# EAGLE design debouncer_4x (EAGLE 6.6.0)
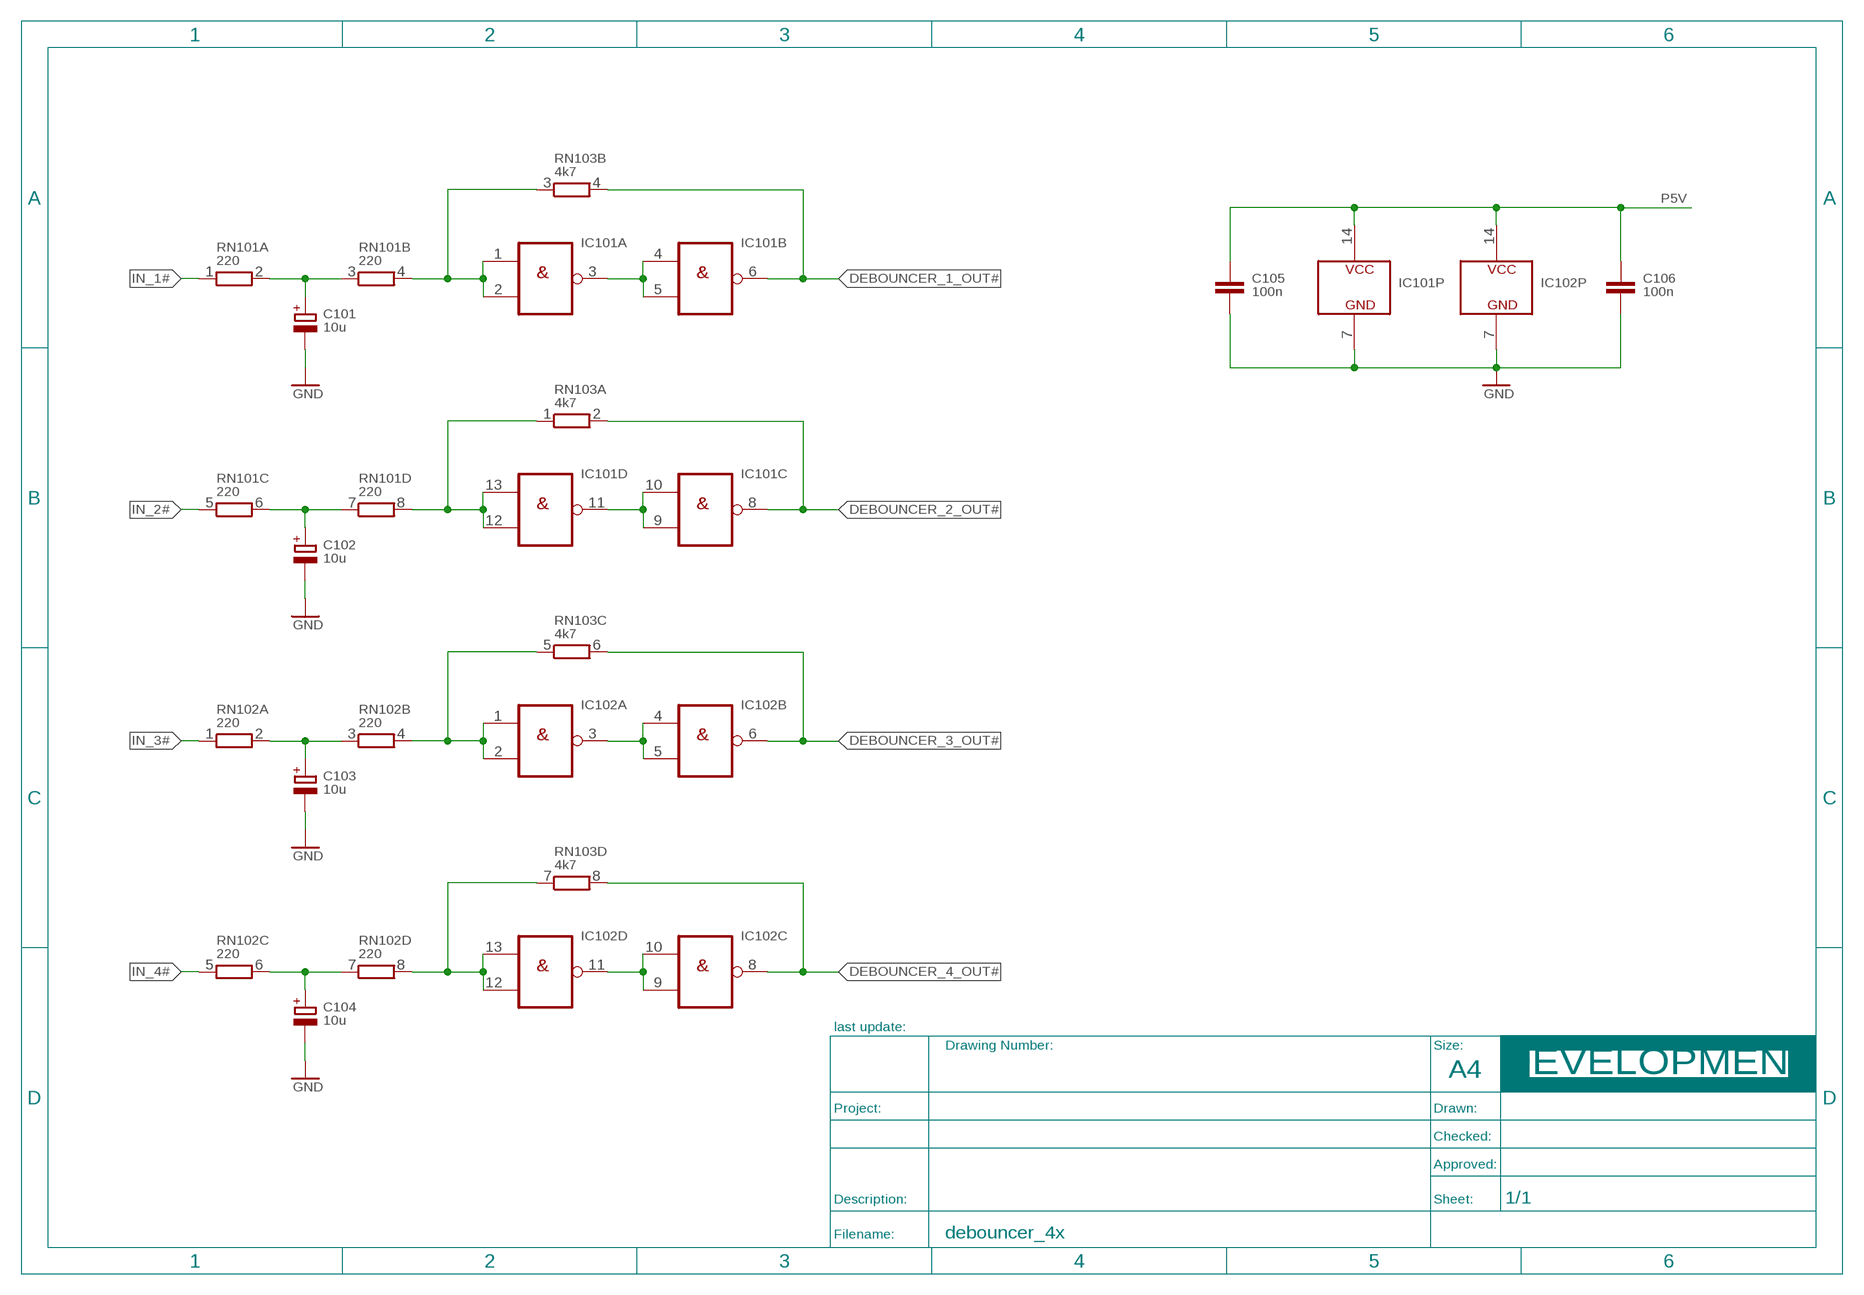
[diagram p0: schematic, sheet 1]
FRAME_DEVELOPMENT1 (A4_LANDSCAPE_DEVELOPMENT): BOM: NO; COMMISSIONED: 2013-08-30

## Parts
C101  10u  C_POL_EU_T_RAD5_GRID_2.54  [T_RADIAL_5MM_GRID_2.54MM]
C102  10u  C_POL_EU_T_RAD5_GRID_2.54  [T_RADIAL_5MM_GRID_2.54MM]
C103  10u  C_POL_EU_T_RAD5_GRID_2.54  [T_RADIAL_5MM_GRID_2.54MM]
C104  10u  C_POL_EU_T_RAD5_GRID_2.54  [T_RADIAL_5MM_GRID_2.54MM]
C105  100n  C_EU_S_0805  [S_0805]
C106  100n  C_EU_S_0805  [S_0805]
IC101  7400N  [T_NDIP14]
IC102  7400N  [T_NDIP14]
RN101  220  R_EU_ARRAY_4  [T_SIL8]
RN102  220  R_EU_ARRAY_4  [T_SIL8]
RN103  4k7  R_EU_ARRAY_4  [T_SIL8]

## Nets
DEBOUNCER_1_OUT#: IC101.6(B:O) RN103.4
DEBOUNCER_2_OUT#: IC101.8(C:O) RN103.2
DEBOUNCER_3_OUT#: IC102.6(B:O) RN103.6
DEBOUNCER_4_OUT#: IC102.8(C:O) RN103.8
DEBOUNCER_10: C101.+ RN101.2 RN101.3
DEBOUNCER_11: IC101.1(A:I0) IC101.2(A:I1) RN101.4 RN103.3
DEBOUNCER_12: IC101.3(A:O) IC101.4(B:I0) IC101.5(B:I1)
DEBOUNCER_20: C102.+ RN101.6 RN101.7
DEBOUNCER_21: IC101.12(D:I1) IC101.13(D:I0) RN101.8 RN103.1
DEBOUNCER_22: IC101.9(C:I1) IC101.10(C:I0) IC101.11(D:O)
DEBOUNCER_30: C103.+ RN102.2 RN102.3
DEBOUNCER_31: IC102.1(A:I0) IC102.2(A:I1) RN102.4 RN103.5
DEBOUNCER_32: IC102.3(A:O) IC102.4(B:I0) IC102.5(B:I1)
DEBOUNCER_40: C104.+ RN102.6 RN102.7
DEBOUNCER_41: IC102.12(D:I1) IC102.13(D:I0) RN102.8 RN103.7
DEBOUNCER_42: IC102.9(C:I1) IC102.10(C:I0) IC102.11(D:O)
GND [pwr]: C101.- C102.- C103.- C104.- C105.2 C106.2 IC101.7(P:GND) IC102.7(P:GND)
IN_1#: RN101.1
IN_2#: RN101.5
IN_3#: RN102.1
IN_4#: RN102.5
P5V [pwr]: C105.1 C106.1 IC101.14(P:VCC) IC102.14(P:VCC)

## Library data of the parts
C101-C104 = be_rcl:C_POL_EU: drawn: Mario Blunk / Blunk electronic; BOM: YES; COMMISSIONED: 2015-01-15; PART_CODE_BEL: C_PAC_T_RADIAL_5mm_GRID_2.54mm_VAL_10u_Vmax_35V
C105 C106 = be_rcl:C_EU: drawn: Mario Blunk / Blunk electronic; BOM: YES; COMMISSIONED: 2013-08-30; PART_CODE_BEL: C_PAC_S_0805_VAL_100n
IC101 IC102 = be_logic:7400: edited: Mario Blunk / Blunk electronic; BOM: YES; COMMISSIONED: 2015-10-14; PART_CODE_BEL: IC_PAC_T_NDIP14_VAL_SN74x00N
RN101 RN102 = be_rcl:R_EU_ARRAY_4: edited: Mario Blunk / Blunk electronic; BOM: YES; COMMISSIONED: 2014-10-14; PART_CODE_BEL: RN_PAC_T_SIL8_VAL_; UPDATED: 2015-10-14
RN103 = be_rcl:R_EU_ARRAY_4: edited: Mario Blunk / Blunk electronic; BOM: YES; COMMISSIONED: 2014-10-14; PART_CODE_BEL: RN_PAC_T_SIL8_VAL_4k7; UPDATED: 2015-10-14

## Net classes
1 pwr: width 0.3 mm

## Board
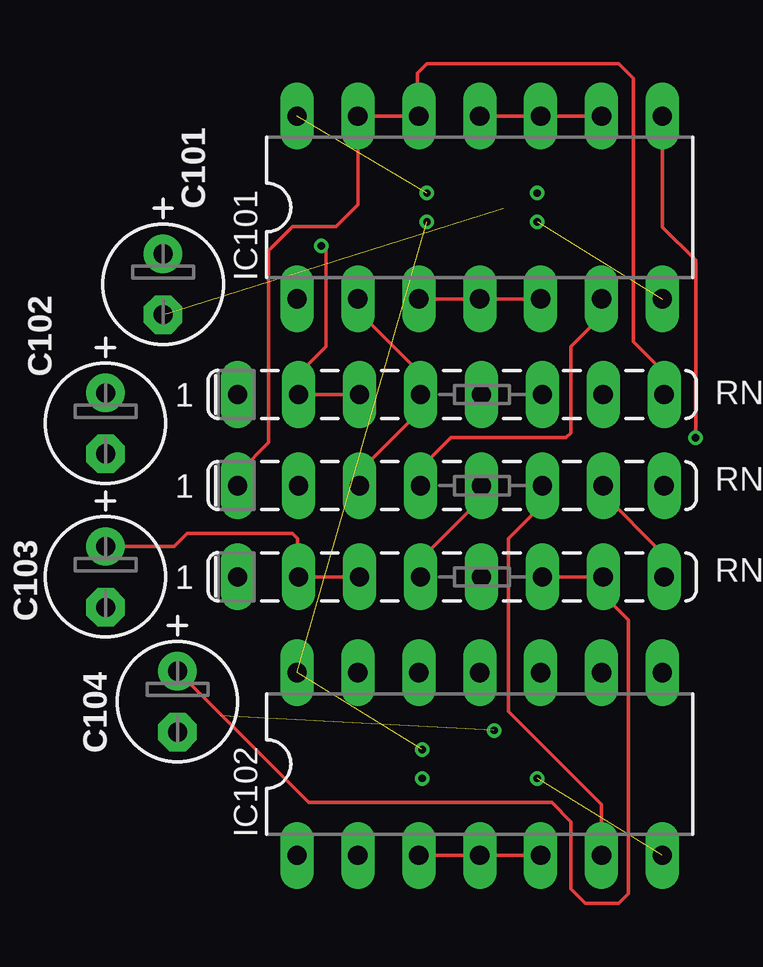
[diagram p1: board, top side]
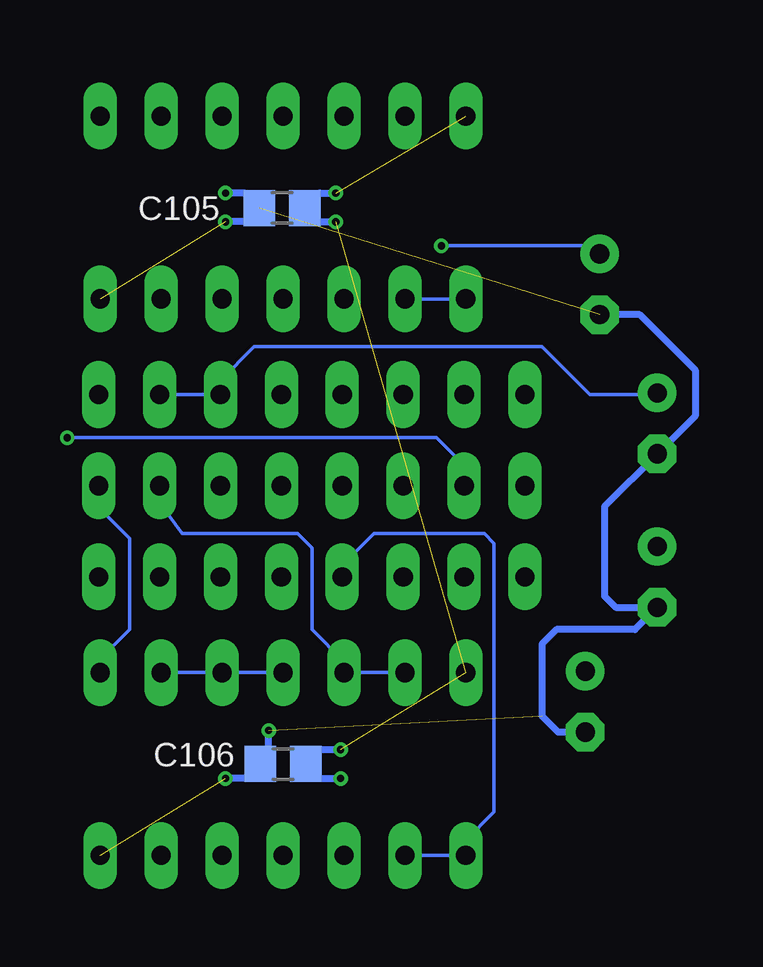
[diagram p2: board, bottom side, seen from below]

No outline drawn. Coordinates in mm, seen from the top.
Copper layers (1*16): Top 0.035mm / dielectric 1.6mm / Bottom 0.035mm
Design rules "JLP_BL_std": minimum track width 0.15mm, minimum drill 0.3mm, track to track 0.15mm, track to pad 0.15mm, pad to pad 0.15mm, via to via 0.15mm, smd to smd 0.15mm, copper to edge 0.5mm, drill to drill 0.2mm, minimum pad ring 0.3mm, minimum via ring 0.15mm, stop-mask expansion 0.075mm, vias tented up to drill 0.3mm, thermal gap 0.2mm

### Footprints (pad centres in the part's own frame; a part is rotated, then mirrored left to right if it is on the bottom)
T_RADIAL_5MM_GRID_2.54MM = drill 0.8 pad 1.6: + -1.27,0 | drill 0.8 pad 1.6 octagon: - 1.27,0
S_0805 = smd 1.3 x 1.5: 1 -0.95,0; 2 0.95,0
T_NDIP14 = drill 0.8 long: 1 -7.62,-3.81; 2 -5.08,-3.81; 3 -2.54,-3.81; 4 0,-3.81; 5 2.54,-3.81; 6 5.08,-3.81; 7 7.62,-3.81; 8 7.62,3.81; 9 5.08,3.81; 10 2.54,3.81; 11 0,3.81; 12 -2.54,3.81; 13 -5.08,3.81; 14 -7.62,3.81
T_SIL8 = drill 0.8 long: 1 -8.89,0; 2 -6.35,0; 3 -3.81,0; 4 -1.27,0; 5 1.27,0; 6 3.81,0; 7 6.35,0; 8 8.89,0

### Placement (x,y rotation side)
C101  8.4,27.2 270 top
C102  6,21.4 270 top
C103  6,15 270 top
C104  9,9.8 270 top
C105  21.64,30.38 180 bottom
C106  21.6,7.2 180 bottom
IC101  21.6,30.4 0 top
IC102  21.6,7.2 0 top
RN101  20.4,22.6 0 top
RN102  20.4,15 0 top
RN103  20.4,18.8 0 top

### Tracks (layer width: path | path; a pad name or v marks a point on that pad's centre or on a via)
DEBOUNCER_1_OUT#
  Top 0.15: IC101.6 26.68,25.88 25.4,24.6 25.4,21 25.2,20.8 20.4,20.8 19.2,19.6 19.2,18.87 RN103.4
DEBOUNCER_2_OUT#  (via drill 0.3)
  Top 0.15: IC101.8 29.22,29.58 30.6,28.2 v30.6,20.8
  Bottom 0.15: RN103.2 14,18.85 14,19.6 15.2,20.8 v30.6,20.8
DEBOUNCER_3_OUT#
  Top 0.15: RN103.6 24.2,18 22.8,16.6 22.8,9.4 26.68,5.52 IC102.6
DEBOUNCER_4_OUT#
  Bottom 0.15: RN103.8 29.2,18.71 29.2,17.8 28,16.6 28,12.8 29.22,11.58 IC102.8
DEBOUNCER_10  (via drill 0.3)
  Top 0.15: RN101.3 RN101.2 14.05,23.45 15.2,24.6 15.2,28.6 v15,28.8
  Bottom 0.15: v15,28.8 8.73,28.8 C101.+
DEBOUNCER_11
  Top 0.15: IC101.2 16.52,26.08 19,23.6 19,22.73 RN101.4 19.2,22.53 19.2,22 16.59,19.39 RN103.3
  Bottom 0.15: IC101.1 IC101.2
DEBOUNCER_12
  Top 0.15: IC101.3 IC101.4 IC101.5
DEBOUNCER_20
  Bottom 0.15: RN101.7 RN101.6 24.21,23.19 22.8,24.6 10.8,24.6 8.8,22.6 6.07,22.6 C102.+
DEBOUNCER_21
  Top 0.15: RN101.8 29.29,23.51 28,24.8 28,35.8 27.4,36.4 19.4,36.4 19,36 19,34.27 IC101.12 IC101.13 16.52,30.52 15.6,29.6 13.8,29.6 12.8,28.6 12.8,20.6 11.6,19.4 11.6,18.89 RN103.1
DEBOUNCER_22
  Top 0.15: IC101.11 IC101.10 IC101.9
DEBOUNCER_30
  Top 0.15: RN102.3 RN102.2 14,15.05 14,16.6 13.8,16.8 9.4,16.8 8.87,16.27 C103.+
DEBOUNCER_31
  Top 0.15: RN103.5 21.67,18.27 19.4,16 19.4,15.27 RN102.4
  Bottom 0.15: RN102.4 19.13,15.47 17.8,16.8 13.2,16.8 12.8,16.4 12.8,5.2 14,4 14,3.41 IC102.1 IC102.2
DEBOUNCER_32
  Top 0.15: IC102.3 IC102.4 IC102.5
DEBOUNCER_40
  Top 0.15: RN102.6 RN102.7 26.75,14.25 27.8,13.2 27.8,1.8 27.4,1.4 26,1.4 25.4,2 25.4,4.8 24.6,5.6 14.47,5.6 C104.+
DEBOUNCER_41
  Top 0.15: RN103.7 26.75,18.45 29.2,16 29.2,15.09 RN102.8
  Bottom 0.15: IC102.13 IC102.12 19.06,11.46 20.4,12.8 20.4,16.2 21,16.8 25.8,16.8 26.4,17.6 RN103.7
DEBOUNCER_42
  Bottom 0.15: IC102.9 IC102.10 IC102.11
GND  (via drill 0.3)  (4 unrouted)
  Bottom 0.3: C101.- 6.73,25.93 4.4,23.6 4.4,21.73 C102.- 8.2,17.93 8.2,14.2 7.73,13.73 C103.- 6.93,12.8 10.2,12.8 10.8,12.2 10.8,9.2 10.13,8.53 C104.- | v22.2,8.6 22.2,7.2 C106.2 23.15,6.6 v24,6.6 | v24,31 23.21,31 C105.2 23.17,29.8 v24,29.8
P5V  (via drill 0.3)  (3 unrouted)
  Bottom 0.3: v19.2,7.8 20.05,7.8 C106.1 20.05,6.6 v19.2,6.6 | v19.4,31 20.07,31 C105.1 20.11,29.8 v19.4,29.8